# Altium schematic sheet main.SchDoc
size A4; SheetNumber: 1; SheetTotal: 7
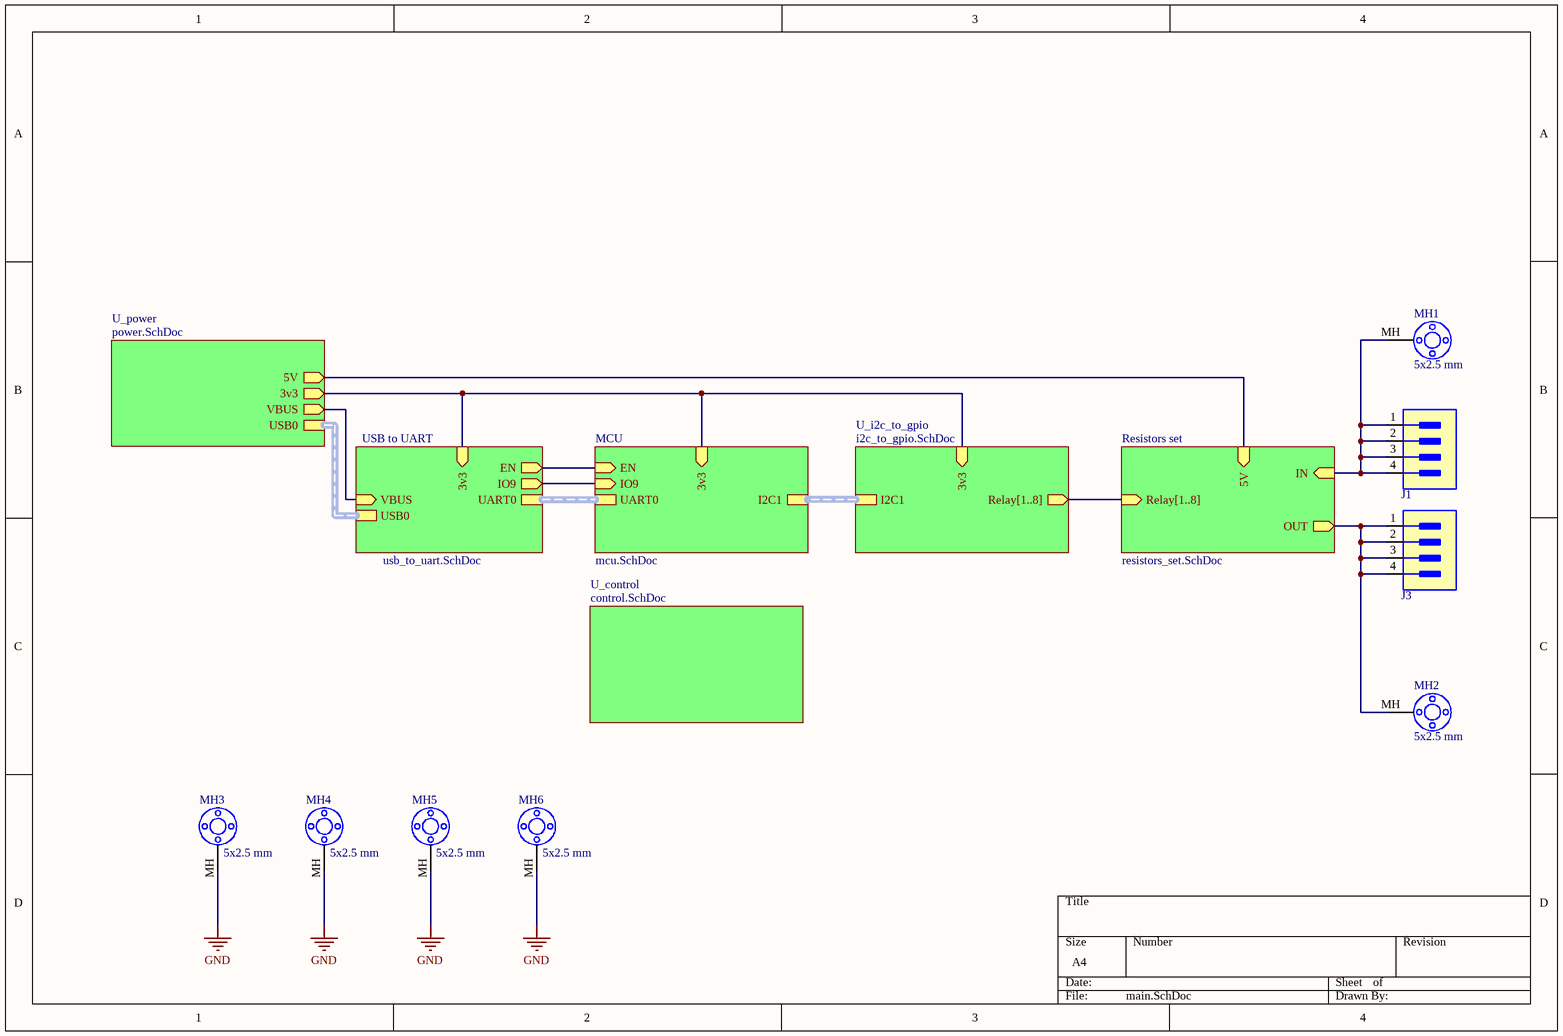
[diagram p0: main.SchDoc]

## Parts
J1  PM254-2-02-Z-8.5  [254-2-2-Fem]  (value not drawn)
J3  PM254-2-02-Z-8.5  [254-2-2-Fem]  (value not drawn)
MH1  5x2.5 mm  [5x2m7_plated_hole]
MH2  5x2.5 mm  [5x2m7_plated_hole]
MH3  5x2.5 mm  [5x2m7_plated_hole]
MH4  5x2.5 mm  [5x2m7_plated_hole]
MH5  5x2.5 mm  [5x2m7_plated_hole]
MH6  5x2.5 mm  [5x2m7_plated_hole]

## Sub-sheets
MCU = mcu.SchDoc: 3v3 (in), I2C1, UART0, EN (in), IO9 (in)
Resistors set = resistors_set.SchDoc: IN (in), OUT (out), 5V (in), Relay[1..8] (in)
U_control = control.SchDoc: no entries
U_i2c_to_gpio = i2c_to_gpio.SchDoc: I2C1 (harness I2C), 3v3 (in), Relay[1..8] (out)
U_power = power.SchDoc: 3v3 (out), 5V (out), VBUS (out), USB0 (harness USB)
USB to UART = usb_to_uart.SchDoc: UART0 (harness UART), 3v3 (in), EN (out), IO9 (out), VBUS (in), USB0

## Nets
GND: MH3.MH MH4.MH MH5.MH MH6.MH
NetJ1_1: J1.1 J1.2 J1.3 J1.4 MH1.MH ; sheet Resistors set/IN
NetJ3_1: J3.1 J3.2 J3.3 J3.4 MH2.MH ; sheet Resistors set/OUT
(unnamed): sheet Resistors set/5V, sheet U_power/5V
(unnamed): sheet MCU/3v3, sheet U_power/3v3, sheet USB to UART/3v3, sheet U_i2c_to_gpio/3v3
(unnamed): sheet MCU/EN, sheet USB to UART/EN
(unnamed): sheet MCU/IO9, sheet USB to UART/IO9
(unnamed): sheet U_power/VBUS, sheet USB to UART/VBUS

## Buses and harness runs
bus sheet Resistors set/Relay[1..8] = sheet U_i2c_to_gpio/Relay[1..8]
harness sheet MCU/I2C1 = sheet U_i2c_to_gpio/I2C1
harness sheet MCU/UART0 = sheet USB to UART/UART0
harness sheet U_power/USB0 = sheet USB to UART/USB0

## Library data of the parts
J1 J3 = PM254-2-02-Z-8.5: 2.54mm 2.54mm 3A Copper Alloy 4P -40℃~+105℃ 260℃@5S Straight 2x2P 8.5mm Top Square Holes Plugin,P=2.54mm Female Headers ROHS; Manufacturer: HCTL; Item: Header 2.54 2x2 Female; Supplier 1: LCSC; Supplier Part Number 1: C2897403; Case: Female; Part Number: PM254-2-02-Z-8.5; HelpURL: https://datasheet.lcsc.com/lcsc/2306091005_HCTL-PM254-2-02-Z-8-5_C2897403.pdf?_gl=1*j2h43v*_ga*MTA1Mzg1NzAxMC4xNzEyNDA1NTIz*_ga_98M84MKSZH*MTcxNzc5MzMyMy44LjEuMTcxNzc5NDE5OC40My4wLjA.; Category: Headers & Wire Housings
MH1-MH6 = none: Plated hole 5x2.5 mm; Part Number: none; Item: 5x2.5 mm; Supplier: none; Case: none; Manufacturer: none; HelpURL: none